# Altium schematic sheet PWR_Supply.SchDoc
size A4; DocumentNumber: 7; SheetNumber: 6; SheetTotal: 7; PostalCode_City: PostalCode_City; Country: Country; Company: Robert BOSCH GmbH; TelefonNumber: TelefonNumber; Street: Street; Department: Department
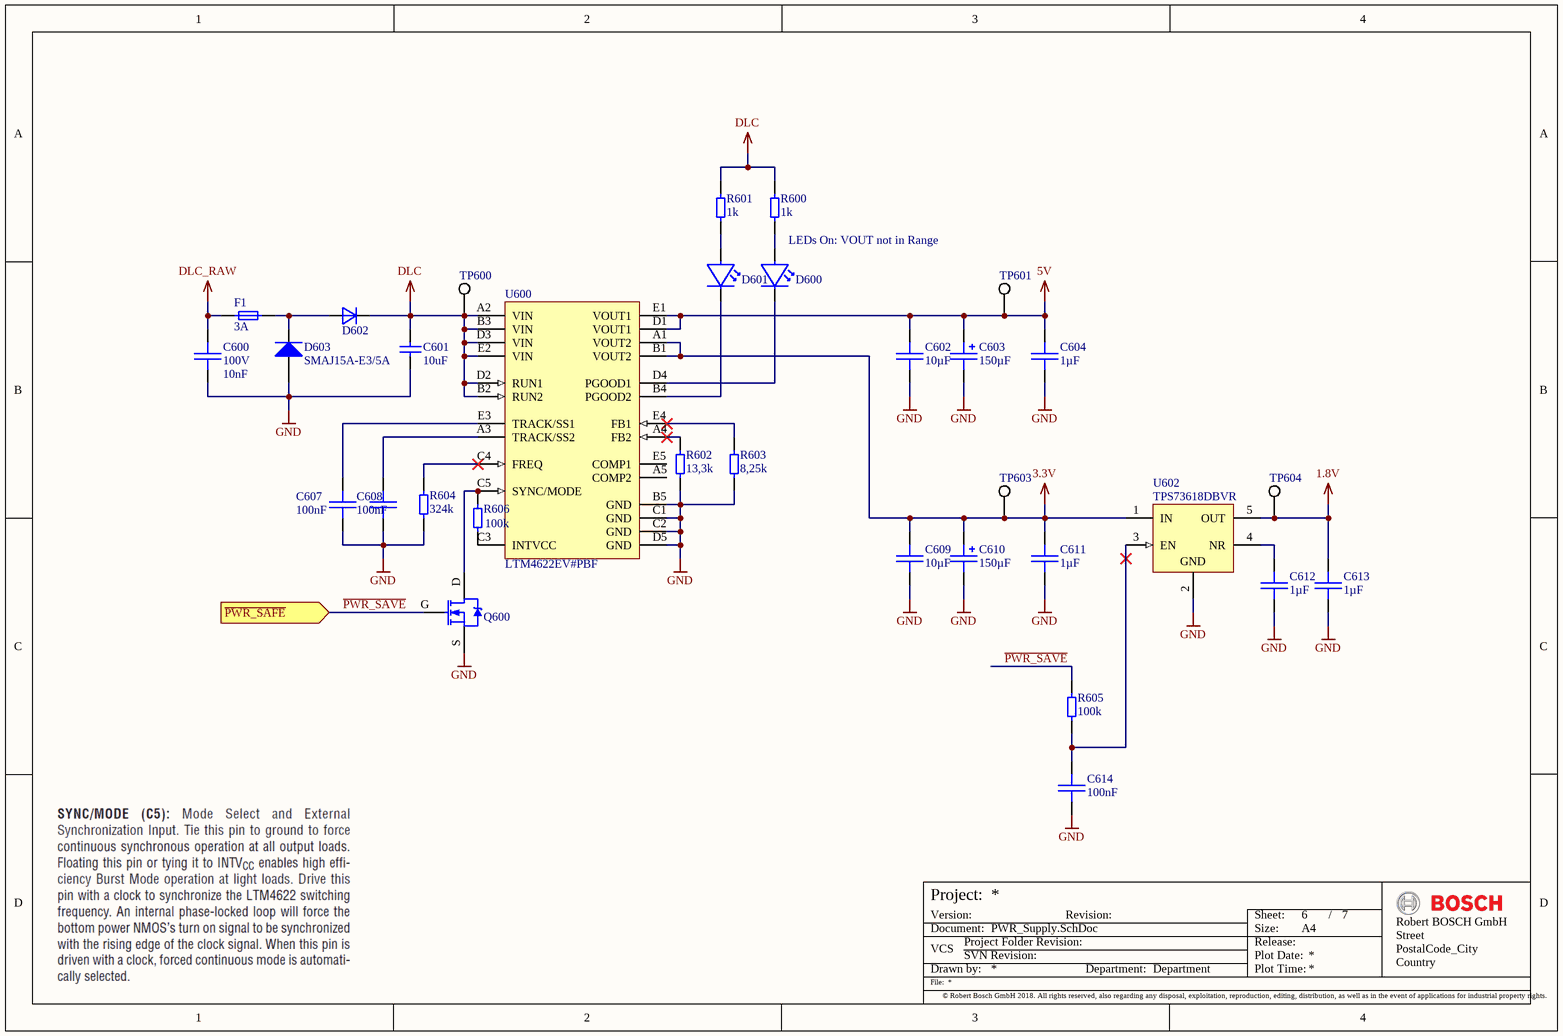
[diagram p0: PWR_Supply.SchDoc]

## Parts
C600  Voltage Rating: 100V  Capacitance: 10nF  [CAP 0603 [1608 Metric] X100 L]  (hidden comment: CAP 0603 10n -10% +10% 100V X7R)
C601  value 10uF  [CAPC1210(3225)190_L]  (hidden comment: CAP 10uF 25V 1210(3225))
C602  Capacitance: 10µF  [CAP 0603 [1608 Metric] X080 N]  (hidden comment: CAP 0603 10µF -10% + 10% 16V X5R)
C603  Capacitance: 150µF  [WCAP-ASLI_6.3x5.5]  (hidden comment: CAP2625 150u -20% +20% 10V)
C604  Capacitance: 1µF  [CAP 0402 [1005 Metric] X050 N]  (hidden comment: CAP 0402 1u -10% +10% 10V X6S)
C607  Capacitance: 100nF  [CAP 0402 [1005 Metric] X050 N]  (hidden comment: CAP 0402 100n -10% +10% 35V X5R)
C608  Capacitance: 100nF  [CAP 0402 [1005 Metric] X050 N]  (hidden comment: CAP 0402 100n -10% +10% 35V X5R)
C609  Capacitance: 10µF  [CAP 0603 [1608 Metric] X080 N]  (hidden comment: CAP 0603 10µF -10% + 10% 16V X5R)
C610  Capacitance: 150µF  [WCAP-ASLI_6.3x5.5]  (hidden comment: CAP2625 150u -20% +20% 10V)
C611  Capacitance: 1µF  [CAP 0402 [1005 Metric] X050 N]  (hidden comment: CAP 0402 1u -10% +10% 10V X6S)
C612  Capacitance: 1µF  [CAP 0402 [1005 Metric] X050 N]  (hidden comment: CAP 0402 1u -10% +10% 10V X6S)
C613  Capacitance: 1µF  [CAP 0402 [1005 Metric] X050 N]  (hidden comment: CAP 0402 1u -10% +10% 10V X6S)
C614  Capacitance: 100nF  [CAP 0402 [1005 Metric] X050 N]  (hidden comment: CAP 0402 100n -10% +10% 35V X5R)
D600  ROHM - SML-P11UT(R)  [ROHM - SML-P11x Series]  (value not drawn)
D601  ROHM - SML-P11UT(R)  [ROHM - SML-P11x Series]  (value not drawn)
D602  VISHAY - S1A-E3  [DIOM4227X23N]  (value not drawn)
D603  SMAJ15A-E3/5A  [VISH-DO-214AC-2_L]
F1  Fuse Current: 3A  [LITTELFUSE - 154 OMNI-BLOK]  (hidden comment: LITTELFUSE - 154003.DRT.)
Q600  ON SEMICONDUCTOR - BSS138  [SOT23127P600-8N]  (value not drawn)
R600  Resistance: 1k  [RES 0402 [1005 Metric]_N]  (hidden comment: RES 0402 1K 1% 62.5mW)
R601  Resistance: 1k  [RES 0402 [1005 Metric]_N]  (hidden comment: RES 0402 1K 1% 62.5mW)
R602  Resistance: 13,3k  [RES 0402 [1005 Metric]_N]  (hidden comment: RES 0402 13K3 1% 62.5mW)
R603  Resistance: 8,25k  [RES 0402 [1005 Metric]_N]  (hidden comment: RES 0402 8k25 1% 100mW)
R604  Resistance: 324k  [RES 0402 [1005 Metric]_N]  (hidden comment: RES 0402 324K 1% 62.5mW)
R605  Resistance: 100k  [RES 0402 [1005 Metric]_N]  (hidden comment: RES 0402 100K 1% 62.5mW)
R606  Resistance: 100k  [RES 0402 [1005 Metric]_N]  (hidden comment: RES 0402 100K 1% 62.5mW)
TP600  Testpad, 1.0mm x 1.0mm, round  [Testpad, 1.0mm x 1.0mm, round]  (value not drawn)  (no BOM)
TP601  Testpad, 1.0mm x 1.0mm, round  [Testpad, 1.0mm x 1.0mm, round]  (value not drawn)  (no BOM)
TP603  Testpad, 1.0mm x 1.0mm, round  [Testpad, 1.0mm x 1.0mm, round]  (value not drawn)  (no BOM)
TP604  Testpad, 1.0mm x 1.0mm, round  [Testpad, 1.0mm x 1.0mm, round]  (value not drawn)  (no BOM)
U600  LTM4622EV#PBF  [LT-LGA-25-6250X6250X1820_V]
U602  TPS73618DBVR  [DBV0005A_L]

## Ports
~{PWR_SAFE} (in)

## Nets
1.8V: C613.2 TP604.1 U602.5(OUT)
3.3V: C609.2 C610.1 C611.2 TP603.1 U600.A1(VOUT2) U600.B1(VOUT2) U602.1(IN)
5V: C602.2 C603.1 C604.2 TP601.1 U600.D1(VOUT1) U600.E1(VOUT1)
DLC: C601.2 D602.C R600.2 R601.2 TP600.1 U600.A2(VIN) U600.B2(RUN2) U600.B3(VIN) U600.D2(RUN1) U600.D3(VIN) U600.E2(VIN)
DLC_RAW: C600.2 F1.1
GND: C600.1 C601.1 C602.1 C603.2 C604.1 C607.2 C608.2 C609.1 C610.2 C611.1 C612.1 C613.1 C614.2 D603.2(A) Q600.S R602.1 R603.1 R604.1 U600.B5(GND) U600.C1(GND) U600.C2(GND) U600.D5(GND) U602.2(GND)
~{PWR_SAVE}: Q600.G R605.2 ; port ~{PWR_SAFE}
NetC607_1: C607.1 U600.E3(TRACK/SS1)
NetC608_1: C608.1 U600.A3(TRACK/SS2)
NetC612_2: C612.2 U602.4(NR)
NetC614_1: C614.1 R605.1 U602.3(EN)
NetD600_A: D600.A R600.1
NetD600_C: D600.C U600.D4(PGOOD1)
NetD601_A: D601.A R601.1
NetD601_C: D601.C U600.B4(PGOOD2)
NetD602_A: D602.A D603.1(K) F1.2
NetQ600_D: Q600.D R606.2 U600.C5(SYNC/MODE)
NetR602_2: R602.2 U600.A4(FB2)
NetR603_2: R603.2 U600.E4(FB1)
NetR604_2: R604.2 U600.C4(FREQ)
NetR606_1: R606.1 U600.C3(INTVCC)

Not connected (* = marked no-connect by the designer): U600 A5(COMP2) E5(COMP1)

## Notes on the sheet
- LEDs On: VOUT not in Range
- Project:
- Version:
- Revision:
- Sheet:
- /
- Document:
- File:
- Drawn by:
- VCS
- Project Folder Revision:
- SVN Revision:
- Department:
- Plot Date:
- Size:
- Plot Time:
- Release:
- A4
- © Robert Bosch GmbH 2018. All rights reserved, also regarding any disposal, exploitation, reproduction, editing, distribution, as well as in the event of applications for industrial property rights.

## Library data of the parts
C600 = CMP-05391-1: SMT Multilayer Ceramic Chip Capacitor for Non-Magnetic Applications (IR Reflow Soldering); Manufacturer: VISHAY; Manufacturer Part Number: VJ0603Y103KCBAJ; RevisionId: 5; ItemHRID: CMP-04705; ReleaseNote: Footprintvarianten und Bestellnummer angepasst; AccessRights: 2147483647; Folder: 10 Library\Component Library\Passive Components\Capacitors\Ceramic Capacitors\; ContentType: Component; Assembly: yes; Value: 10nF; LifeCycleStateGUID: E3052186-9469-4B71-ADAB-0D319103D948; ReleaseDate: 13/06/2018 08:16:35 AM; ContentTypeGUID: CB3C11C4-E317-11DF-B822-12313F0024A2; ItemGUID: 65A320EC-B35E-4E2F-B576-051AFF40A2FD; FolderGUID: 1B932E09-F2A4-48AF-86E9-372599342254; LifeCycle: In Design; ComponentType: Ceramic Capacitor; ComponentLink1URL: http://www.vishay.com/docs/45227/nonmagneticirrefsold.pdf; Capacitance Tolerance neg: -10%; Capacitance Tolerance pos: +10%; Case: 0603 [1608]; ComponentLink1Description: Datasheet; Dielectric Type: X7R; Mounting Type: SMT; Operating Temperature max: 125°C; Operating Temperature min: -55°C; Supplier: Farnell; SupplierID: 2672793
C601 = CMP-1038-02233-1: CAP 10uF 25V -20% to +80% 1210 (3225 Metric) Thickness 1.9mm SMD; Case-Metric: 3225; Case-EIA: 1210; Max Thickness: 1.9 mm; Rated Voltage: 25 V; Tolerance: -20% to +80%; Technology: SMT
C602 C609 = CMP-05416-1: Cap Ceramic 10uF 16V X5R 10% Pad SMD 0603 85 T/R; Manufacturer: MURATA; Manufacturer Part Number: GRM188R61C106KAALD; Assembly: yes; Capacitance Tolerance pos: +10%; Capacitance Tolerance neg: -10%; Case: 0603 [1608]; ComponentLink1Description: Datasheet; ComponentLink1URL: https://search.murata.co.jp/Ceramy/image/img/A01X/G101/ENG/GRM188R61C106KAAL-01.pdf; Dielectric Type: X5R; Mounting Type: SMT; Operating Temperature max: 85°C; Operating Temperature min: -55°C; Value: 10µF; Voltage Rating: 16V
C603 C610 = CMP-04590-3: WCAP-ASLL Aluminium Electrolytic Capacitor (SMD Type): -55°C to 105°, Reflow Soldering, Low Impedance; Manufacturer: WUERTH ELEKTRONIK; Manufacturer Part Number: 865060243005; Ripple Frequency: 100kHz; Value: 150µF; Assembly: yes; Capacitance Tolerance pos: 20%; Impedance: 0.44; Ripple Current max: 250mA; Leak Current: 15µA; Capacitance Tolerance neg: -20%; Voltage Rating: 10V; ComponentLink1Description: Datasheet; ComponentLink1URL: http://katalog.we-online.de/pbs/datasheet/865060243005.pdf; Case: Radial SMD; Mounting Type: SMT; Operating Temperature max: 105°C; Operating Temperature min: -55°C
C604 C611-C613 = CMP-05092-2: SMD/SMT 0402 10V -10% +10% X6S - Mulitlayer Ceramic Capacitors MLCC; Manufacturer: TDK; Manufacturer Part Number: C1005X6S1A105K050BC; Assembly: yes; Capacitance Tolerance pos: 10%; Value: 1µF; Capacitance Tolerance neg: -10%; Case: 0402 [1005]; ComponentLink1Description: Datasheet; ComponentLink1URL: http://www.farnell.com/datasheets/2291921.pdf; Dielectric Type: X6S; Mounting Type: SMT; Operating Temperature max: 105°C; Operating Temperature min: -55°C; Voltage Rating: 10V
C607 C608 C614 = CMP-06091-1: SMD/SMT 0402 35V -10% +10% X5R - Multilayer Ceramic Capacitors MLCC; Manufacturer: TDK; Manufacturer Part Number: C1005X5R1V104K050BB; Assembly: yes; Value: 100nF; Capacitance Tolerance pos: 10%; Case: 0402 [1005]; ComponentLink1Description: Datasheet; ComponentLink1URL: https://de.farnell.com/tdk/c1005x5r1v104k050bb/kondensator-0-1-f-35v-10-x5r-0402/dp/2528760?st=100n%200402%2035v; Dielectric Type: X5R; IPC Footprint Naming: CAPC1005X050; Mounting Type: SMT; Operating Temperature max: 85°C; Operating Temperature min: -55°C; Voltage Rating: 35V; Capacitance Tolerance neg: -10%
D600 D601 = CMP-06093-1: Standard LEDs - SMD Red 621nm 2.5mcd 50mW Pd 1.8V Vf; Assembly: yes; Forward Current LED1: 20mA; Reverse Voltage LED1: 5V; Case: 0402; Colour LED1: red; ComponentLink1Description: Datahseet; ComponentLink1URL: https://d1d2qsbl8m0m72.cloudfront.net/en/products/databook/datasheet/opto/led/chip_mono/sml-p11-e.pdf; Forward Voltage LED1: 1.8V; Luminous Intensity LED1: 2.5mcd; Manufacturer: ROHM; Manufacturer Part Number: SML-P11UT(R); Mounting Type: SMT; Operating Temperature max: 85°C; Operating Temperature min: -40°C; Wavelength LED1: 621nm
D602 = CMP-04677-4: 50V Surface Mount Glass Passivated Rectifier; Assembly: yes; Forward Current: 1A; Forward Voltage: 1.1V; Reverse Current: 1µA; Reverse Recovery Time: 1.8µs; Case: DO-214AC; ComponentLink1Description: Datasheet; ComponentLink1URL: http://www.vishay.com/diodes/list/product-88711/; Manufacturer: VISHAY; Manufacturer Part Number: S1A-E3; Mounting Type: SMT; Operating Temperature max: 150°C; Operating Temperature min: -55°C; Reverse Voltage: 50V
D603 = CMP-0548-00307-2: Transient Voltage Suppressor, 6.40 to 231 V, 15 V Stand-off Voltage, Uni-Directional, -55 to 155 degC, 2-pin DO-214AC, Pb-Free, Tape and Reel; Manufacturer: Vishay Semiconductor; VBR Uni-Directional (V): 6.4 to 231; IFSM: 40 A; ID (uA): 1; VWM (V): 15; PPPM (W): 400, 300; RoHS: TRUE; ComponentLink1Description: Manufacturer URL; PackageReference: DO-214AC-2; ComponentLink3Description: Package Specification; ComponentLink3URL: http://www.vishay.com/docs/88390/smaj50a.pdf; Operating Junction and Storage Temperature Range: -55 to 150 degC; ComponentLink1URL: http://www.vishay.com/; Mounting Technology: Surface Mount; PackageDescription: 2-Pin DO-214AC (SMA), Body 4.245 x 2.665 mm; ComponentLink2URL: http://www.vishay.com/docs/88390/smaj50a.pdf; ComponentLink2Description: Datasheet; PartNumber: SMAJ15A-E3/5A; Packing: Tape and Reel; DatasheetVersion: 12/8/2013
F1 = CMP-00372-3: Sicherung 3A - NANO2 > 154 OMNI-BLOK - Fuse and Holder Combination; Assembly: yes; Blow Characteristic: T; Voltage Rating AC/DC: 125VDC; Case: 154 Series; ComponentLink1Description: Manufacturer Link; ComponentLink1URL: http://www.littelfuse.de/products/fuse-blocks-fuseholders-and-fuse-accessories/fuse-blocks/154.aspx; Manufacturer: LITTELFUSE; Manufacturer Part Number: 154003.DRT.; Mounting Type: SMT; Operating Temperature max: 125°C; Operating Temperature min: -55°C
Q600 = CMP-00444-5: MOSFET N-CH 50V 220MA SOT-23; Threshold Voltage: 1.3V; Transistor Polarity: N-Channel; Assembly: yes; Drain Source On Resistance: 3.5; Gate Source Voltage: 20V; Operating Temperature min: -55°C; Case: SOT23-3; ComponentLink1Description: Datasheet; ComponentLink1URL: https://www.onsemi.com/pub/Collateral/BSS138-D.PDF; Drain Current DC: 220mA; Drain Source Voltage: 50V; Manufacturer: ON SEMICONDUCTOR; Manufacturer Part Number: BSS138; Mounting Type: SMT; Operating Temperature max: 150°C
R600 R601 = CMP-00843-3: RC0402 series chip resistor with lead-free terminations made by thick film process; Manufacturer Part Number: RC0402FR-071KL; Manufacturer: YAGEO; Power Rating: 62,5mW; Temperature Coefficient: ±100ppm/K; Voltage Rating: 50V; Assembly: yes; Current Rating: 1A; Mounting Type: SMT; Operating Temperature max: 155°C; Operating Temperature min: -55°C; Resistance Tolerance: 1%; Resistor Element Type: Thick Film; Value: 1k; Case: 0402 [1005]; ComponentLink1Description: Datasheet; ComponentLink1URL: http://www.yageo.com/documents/recent/PYu-RC0402_51_RoHS_L_6.pdf; IPC Footprint Naming: RESC1005X04
R602 = CMP-00972-3: RC0402 series chip resistor with lead-free terminations made by thick film process; Manufacturer: YAGEO; Manufacturer Part Number: RC0402FR-0713K3L; Voltage Rating: 50V; Power Rating: 62,5mW; Temperature Coefficient: ±100ppm/K; Value: 13,3k; Assembly: yes; Current Rating: 1A; IPC Footprint Naming: RESC1005X04; Mounting Type: SMT; Operating Temperature max: 155°C; Operating Temperature min: -55°C; Resistance Tolerance: 1%; Resistor Element Type: Thick Film; Case: 0402 [1005]; ComponentLink1Description: Datasheet; ComponentLink1URL: http://www.yageo.com/documents/recent/PYu-RC0402_51_RoHS_L_6.pdf
R603 = CMP-04839-2: 0402 series chip resistor with lead-free terminations made by thick film process; Manufacturer: Panasonic; Manufacturer Part Number: ERJ-2RKF8251X; Assembly: yes; Value: 8,25k; Voltage Rating: 50V; Case: 0402; Mounting Type: SMT; Operating Temperature max: 155°C; Operating Temperature min: -55°C; Power Rating: 100mW; Resistance Tolerance: 1%
R604 = CMP-01135-3: RC0402 series chip resistor with lead-free terminations made by thick film process; Manufacturer: YAGEO; Manufacturer Part Number: RC0402FR-07324KL; Assembly: yes; Current Rating: 1A; Power Rating: 62,5mW; Temperature Coefficient: ±100ppm/K; Voltage Rating: 50V; IPC Footprint Naming: RESC1005X04; Mounting Type: SMT; Operating Temperature max: 155°C; Case: 0402 [1005]; ComponentLink1Description: Datasheet; ComponentLink1URL: http://www.yageo.com/documents/recent/PYu-RC0402_51_RoHS_L_6.pdf; Operating Temperature min: -55°C; Resistance Tolerance: 1%; Resistor Element Type: Thick Film; Value: 324k
R605 R606 = CMP-01074-3: RC0402 series chip resistor with lead-free terminations made by thick film process; Manufacturer: YAGEO; Manufacturer Part Number: RC0402FR-07100KL; Assembly: yes; Current Rating: 1A; Power Rating: 62,5mW; Temperature Coefficient: ±100ppm/K; Voltage Rating: 50V; Case: 0402 [1005]; ComponentLink1Description: Datasheet; ComponentLink1URL: http://www.yageo.com/documents/recent/PYu-RC0402_51_RoHS_L_6.pdf; IPC Footprint Naming: RESC1005X04; Mounting Type: SMT; Operating Temperature max: 155°C; Operating Temperature min: -55°C; Resistance Tolerance: 1%; Resistor Element Type: Thick Film; Value: 100k
TP600 TP601 TP603 TP604 = CMP-04511-8: Assembly: no; Case: 1.0x1.0mm, round
U600 = CMP-2000-06613-1: Dual Ultrathin Step-Down DC/DC uModule Regulator, 2.5 A, 3.6 to 20 V, -40 to 125 degC, 25-Pin LGA, RoHS, Tray; Manufacturer: LinearTechnology; Voltage - Input (Min): 3.6V; Voltage - Output 1: 0.6~5.5V; Package Version: Rev. 0, 06/2013; Current - Output (Max): 2.5A; Number of Outputs: 1; Voltage - Input (Max): 20V; Type: Non-IsolatedPoLModule; Power (Watts) - Max: -; Mounting Technology: SurfaceMount; Applications: ITE(Commercial); Series: µModule®; Category: PowerSupplies-BoardMount; Package Description: 25-Pin LGA, Body 6.25 x 6.25 mm, Pitch 1.27 mm; Package / Case: 25-LGA; Size / Dimension: 0.25"Lx0.25"Wx0.07"H(6.3mmx6.3mmx1.8mm); Family: DCDCConverters; Mounting Type: SurfaceMount; Datasheet Version: Rev. B, 01/2016; Manufacturer URL: http://www.linear.com/; Operating Temperature: -40°C~125°C; Efficiency: -; Voltage - Output 2: -; Power (Watts) - Manufacture Series: -; Features: OCP,OTP,OVP; Packaging: Tray; Package URL: http://www.linear.com/docs/43379; Package Reference: LGA-25; Datasheet URL: http://cds.linear.com/docs/en/datasheet/4622fb.pdf; Voltage - Isolation: -; Voltage - Output 3: -
U602 = CMP-0395-00289-2: Single Output Low Noise LDO, 400 mA, Fixed 1.8 V Output, 1.7 to 5.5 V Input, with Reverse Current Protection, 5-pin SOT-23 (DBV), -40 to 85 degC, Green (RoHS & no Sb/Br); Manufacturer: Texas Instruments; Iout(Max)(A): 0.4; Vdo(Typ)(mV): 75; SubFamily: Single Channel LDO; Fixed Output Options(V): 1.8; Vin(Min)(V): 1.7; Rating: Catalog; Iq(Typ)(mA): 0.3; Accuracy(%): 1; Vin(Max)(V): 5.5; ComponentLink1URL: http://www.ti.com/; ComponentLink4URL: Samples URL:http://www.ti.com/product/tps73618#samples; Mounting Technology: Surface Mount; ComponentLink3Description: Package Specification; ComponentLink1Description: Manufacturer URL; ComponentLink2URL: http://www.ti.com/general/docs/lit/getliterature.tsp?genericPartNumber=TPS73618&fileType=pdf; ComponentLink3URL: http://www.ti.com/litv/pdf/mpds018i; PackageReference: DBV0005A; Vout Adj(Max)(V): 1.8; DatasheetVersion: SBVS038T; Vout Adj(Min)(V): 1.8; PackageVersion: 4073253-4/K; ComponentLink2Description: Datasheet; Code_JEDEC: MO-178; ComponentLink4Description: URL Link1; Eco-Plan: Green (RoHS & no Sb/Br); PartNumber: TPS73618DBVR; PackageDescription: 5-Pin Plastic Small Outline, Body 1.60 Ãƒâ€” 2.90 mm, Pitch 0.95 mm